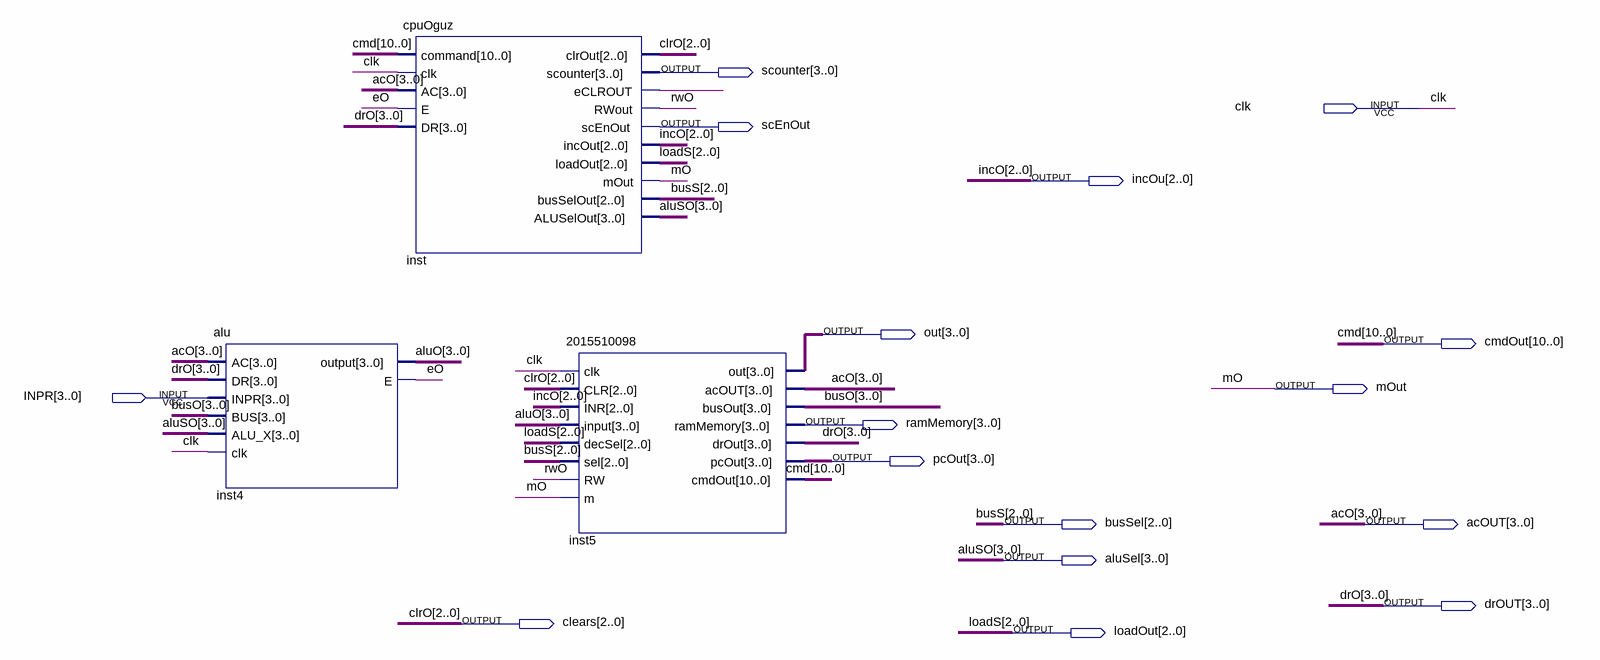
[diagram p0: schematic sheet]
// Quartus schematic cmpOguz.bdf as structural Verilog: 3 symbols, 16 pins
module cmpOguz (
  input  clk,
  input  [3:0] INPR,
  output [3:0] scounter,
  output scEnOut,
  output [2:0] incOu,
  output [3:0] out,
  output [10:0] cmdOut,
  output mOut,
  output [3:0] ramMemory,
  output [3:0] pcOut,
  output [2:0] busSel,
  output [3:0] acOUT,
  output [3:0] aluSel,
  output [3:0] drOUT,
  output [2:0] clears,
  output [2:0] loadOut
);

  wire eO, inst_eclrout, rwO;
  wire [3:0] aluO, busO;

  alu inst4 (.AC(acOUT), .DR(drOUT), .INPR(INPR), .BUS(busO), .ALU_X(aluSel), .clk(clk), .\output (aluO), .E(eO));
  cpuOguz inst (
    .command(cmdOut), .clk(clk), .AC(acOUT), .E(eO), .DR(drOUT), .clrOut(clears), .scounter(scounter),
    .eCLROUT(inst_eclrout), .RWout(rwO), .scEnOut(scEnOut), .incOut(incOu), .loadOut(loadOut), .mOut(mOut),
    .busSelOut(busSel), .ALUSelOut(aluSel));
  \2015510098  inst5 (
    .clk(clk), .CLR(clears), .INR(incOu), .\input (aluO), .decSel(loadOut), .sel(busSel), .RW(rwO), .m(mOut),
    .out(out), .acOUT(acOUT), .busOut(busO), .ramMemory(ramMemory), .drOut(drOUT), .pcOut(pcOut),
    .cmdOut(cmdOut));

  // Other names for the same wires on the sheet: acO[3:0] = acOUT; aluSO[3:0] = aluSel; busS[2:0] = busSel;
  //   clrO[2:0] = clears; cmd[10:0] = cmdOut; drO[3:0] = drOUT; incO[2:0] = incOu; loadS[2:0] = loadOut; mO = mOut
endmodule
